# Altium schematic sheet Power.SchDoc: Power Supplies
size Letter; Date: 2017-02-17; Revision: A; SheetNumber: 2; SheetTotal: 11; ProjectTitle: PDUv17: Power Distribution Unit
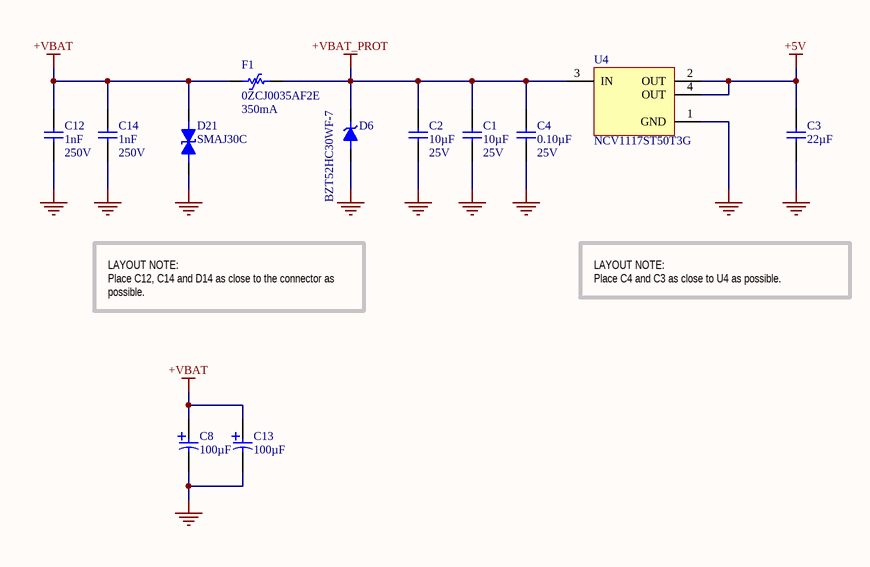
[diagram p0: Power.SchDoc]

## Parts
C1  value 10µF  Voltage: 25V  [CAP-1206-M]  (hidden comment: CAP 10µF ±10% 25V 1206 X7R)
C2  value 10µF  Voltage: 25V  [CAP-1206-M]  (hidden comment: CAP 10µF ±10% 25V 1206 X7R)
C3  value 22µF  [CAP-1206-M]  (hidden comment: CAP 22µF ±10% 10V 1206 X7R)
C4  value 0.10µF  Voltage: 25V  [CAP-0402-M]  (hidden comment: CAP 0.10µF ±10% 25V 0402 X7R)
C8  value 100µF  [CAPAE7066X80M]  (hidden comment: EEE-FK1V101XP)
C12  value 1nF  Voltage: 250V  [CAP-0805-M]  (hidden comment: CAP 1nF ±10% 250V 0805 X7R)
C13  value 100µF  [CAPAE7066X80M]  (hidden comment: EEE-FK1V101XP)
C14  value 1nF  Voltage: 250V  [CAP-0805-M]  (hidden comment: CAP 1nF ±10% 250V 0805 X7R)
D6  BZT52HC30WF-7  [SODFL340X115-2N]
D21  SMAJ30C  [SON127P500X135-2N]
F1  0ZCJ0035AF2E  value 350mA  [0ZCJ-1206-0.9]
U4  NCV1117ST50T3G  [SOT230P700X180-4N]

## Nets
+5V: C3.2 U4.2(OUT) U4.4(OUT)
+VBAT: C8.2 C12.1 C13.2 C14.1 D21.1 F1.1
+VBAT_PROT: C1.2 C2.2 C4.2 D6.1(K) F1.2 U4.3(IN)
GND: C1.1 C2.1 C3.1 C4.1 C8.1 C12.2 C13.1 C14.2 D6.2(A) D21.2 U4.1(GND)

## Notes on the sheet
- LAYOUT NOTE:
  Place C12, C14 and D14 as close to the connector as possible.
- LAYOUT NOTE:
  Place C4 and C3 as close to U4 as possible.
- Date:
- Revision:
- Sheet:
- /

## Library data of the parts
C1 C2 = CC1206KKX7R8BB106: Manufacturer: Yageo; Manufacturer Series: CC; Part Number: CC1206KKX7R8BB106; Component Type: Standard; Tolerance: ±10%; Package: 1206; Temperature Coefficient: X7R; Temperature Range: -55°C ~ 125°C; Supplier 1: Digi-Key; Supplier Part Number 1: 311-1959-1-ND
C3 = CC1206KKX7R6BB226: Manufacturer: Yageo; Manufacturer Series: CC; Part Number: CC1206KKX7R6BB226; Component Type: Standard; Tolerance: ±10%; Voltage: 10V; Package: 1206; Temperature Coefficient: X7R; Temperature Range: -55°C ~ 125°C; Supplier 1: Digi-Key; Supplier Part Number 1: 311-1954-1-ND
C4 = CC0402KRX7R8BB104: Manufacturer: Yageo; Manufacturer Series: CC; Part Number: CC0402KRX7R8BB104; Component Type: Standard; Tolerance: ±10%; Package: 0402; Temperature Coefficient: X7R; Temperature Range: -55°C ~ 125°C; Supplier 1: Digi-Key; Supplier Part Number 1: 311-2077-1-ND
C12 C14 = CC0805KRX7RYBB102: Manufacturer: Yageo; Manufacturer Series: CC; Part Number: CC0805KRX7RYBB102; Component Type: Standard; Tolerance: ±10%; Package: 0805; Temperature Coefficient: X7R; Temperature Range: -55°C ~ 125°C; Supplier 1: Digi-Key; Supplier Part Number 1: 311-1470-1-ND
C8 C13 = EEE-FK1V101XP: Supplier 1: Digi-Key; Supplier Part Number 1: PCE3836CT-ND
D6 = BZT52HC30WF-7: Supplier 1: Digi-Key; Supplier Part Number 1: BZT52HC30WF-7DICT-ND
U4 = NCV1117ST50T3G: Supplier 1: Digi-Key; Supplier Part Number 1: NCV1117ST50T3GOSCT-ND